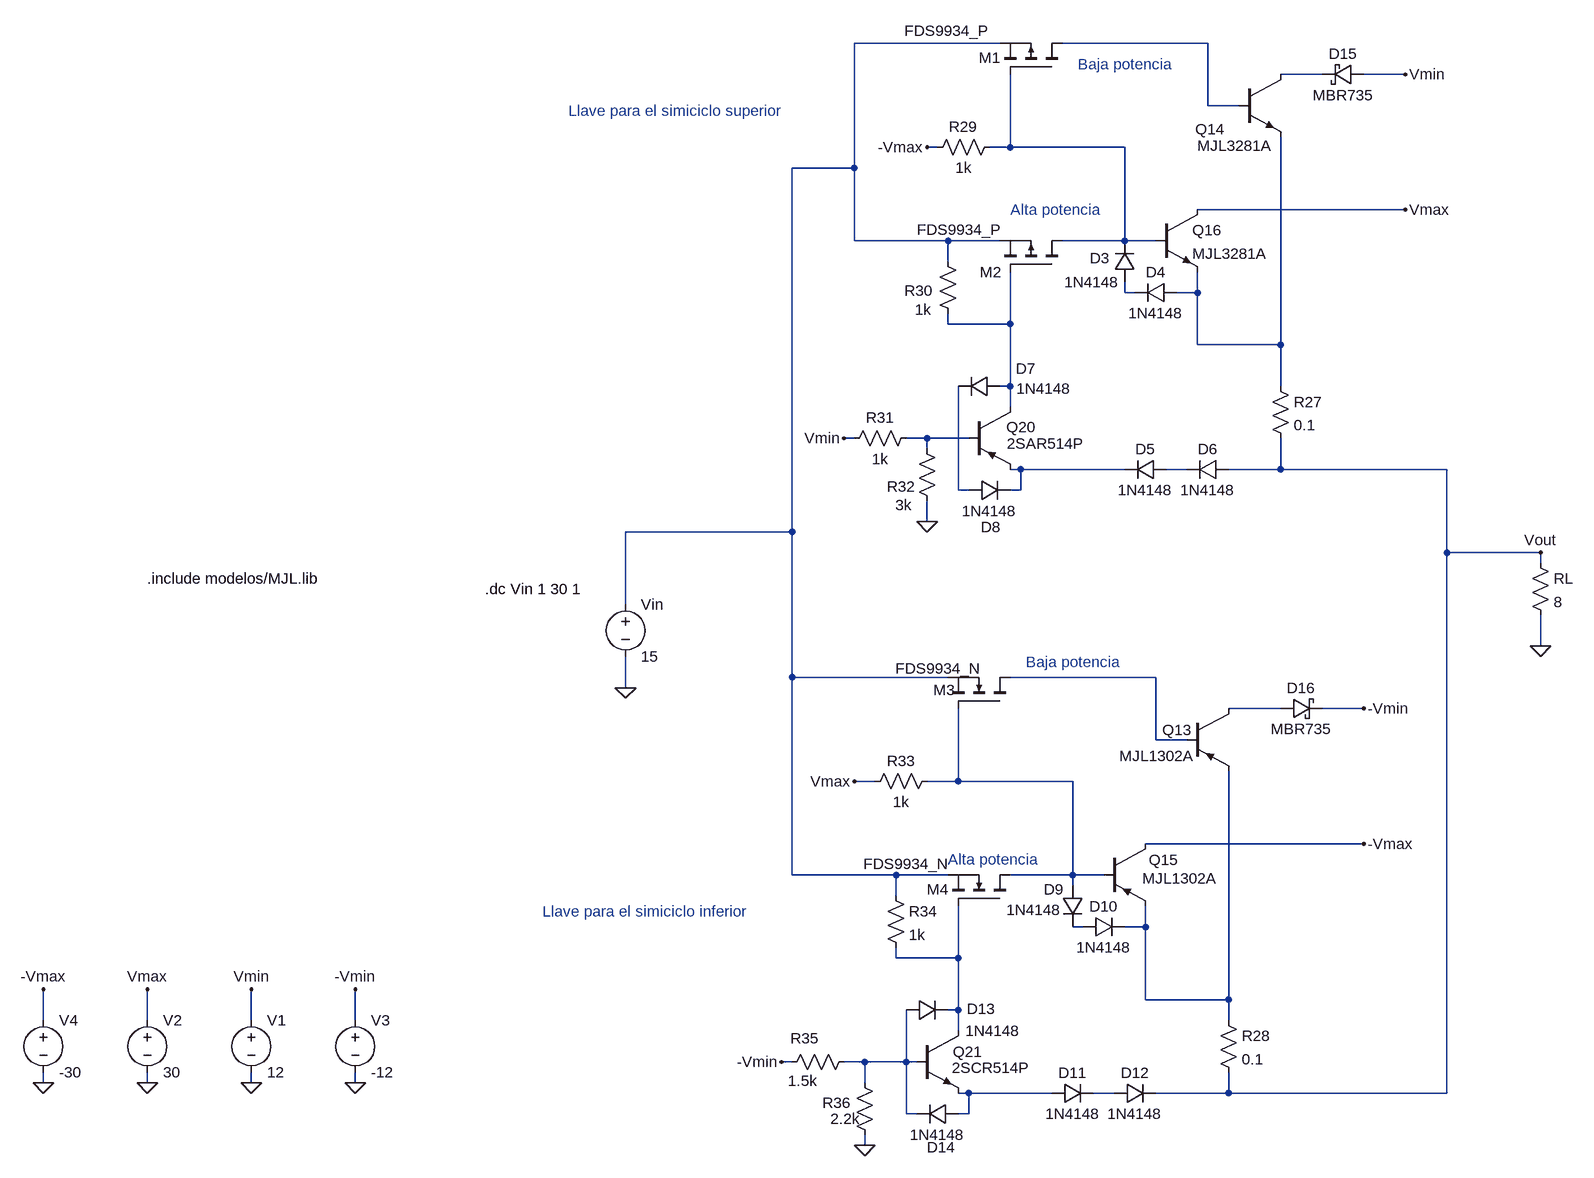
[diagram p0: schematic prueba_llaves_ambos_semiciclos.asc]
prueba_llaves_ambos_semiciclos.asc, the LTspice schematic file:
Version 4
SHEET 1 1968 1748
WIRE 144 -176 -80 -176
WIRE 464 -176 240 -176
WIRE 640 -128 576 -128
WIRE 768 -128 704 -128
WIRE 464 -80 464 -176
WIRE 512 -80 464 -80
WIRE 48 -16 32 -16
WIRE 160 -16 160 -128
WIRE 160 -16 128 -16
WIRE 336 -16 160 -16
WIRE -80 16 -80 -176
WIRE -80 16 -176 16
WIRE 768 80 448 80
WIRE -80 128 -80 16
WIRE 64 128 -80 128
WIRE 144 128 64 128
WIRE 336 128 336 -16
WIRE 336 128 240 128
WIRE 384 128 336 128
WIRE 64 160 64 128
WIRE 336 208 336 192
WIRE 352 208 336 208
WIRE 448 208 448 176
WIRE 448 208 416 208
WIRE 64 256 64 240
WIRE 160 256 160 176
WIRE 160 256 64 256
WIRE 448 288 448 208
WIRE 576 288 576 -32
WIRE 576 288 448 288
WIRE 160 352 160 256
WIRE 160 352 144 352
WIRE 576 352 576 288
WIRE 160 384 160 352
WIRE -80 432 -96 432
WIRE 32 432 0 432
WIRE 96 432 32 432
WIRE 32 448 32 432
WIRE 176 480 160 480
WIRE 336 480 176 480
WIRE 432 480 400 480
WIRE 576 480 576 432
WIRE 576 480 496 480
WIRE 832 480 576 480
WIRE 80 512 80 352
WIRE 96 512 80 512
WIRE 176 512 176 480
WIRE 176 512 160 512
WIRE 32 560 32 528
WIRE -176 576 -176 16
WIRE -176 576 -432 576
WIRE 832 608 832 480
WIRE 976 608 832 608
WIRE 976 624 976 608
WIRE -432 688 -432 576
WIRE 976 752 976 704
WIRE -176 800 -176 576
WIRE 64 800 -176 800
WIRE 384 800 160 800
WIRE -432 816 -432 768
WIRE 576 848 496 848
WIRE 704 848 640 848
WIRE 384 896 384 800
WIRE 432 896 384 896
WIRE -48 960 -80 960
WIRE 80 960 80 848
WIRE 80 960 32 960
WIRE 256 960 80 960
WIRE 704 1056 368 1056
WIRE -176 1104 -176 800
WIRE -16 1104 -176 1104
WIRE 64 1104 -16 1104
WIRE 256 1104 256 960
WIRE 256 1104 160 1104
WIRE 304 1104 256 1104
WIRE 256 1120 256 1104
WIRE -16 1136 -16 1104
WIRE 272 1184 256 1184
WIRE 368 1184 368 1152
WIRE 368 1184 336 1184
WIRE -16 1232 -16 1216
WIRE 80 1232 80 1152
WIRE 80 1232 -16 1232
WIRE 368 1296 368 1184
WIRE 496 1296 496 944
WIRE 496 1296 368 1296
WIRE 80 1312 80 1232
WIRE 80 1312 64 1312
WIRE -1328 1328 -1328 1280
WIRE -1168 1328 -1168 1280
WIRE -1008 1328 -1008 1280
WIRE -848 1328 -848 1280
WIRE 496 1328 496 1296
WIRE 80 1344 80 1312
WIRE -176 1392 -192 1392
WIRE -64 1392 -96 1392
WIRE 0 1392 0 1312
WIRE 0 1392 -64 1392
WIRE 16 1392 0 1392
WIRE -1328 1424 -1328 1408
WIRE -1168 1424 -1168 1408
WIRE -1008 1424 -1008 1408
WIRE -848 1424 -848 1408
WIRE -64 1424 -64 1392
WIRE 96 1440 80 1440
WIRE 224 1440 96 1440
WIRE 320 1440 288 1440
WIRE 496 1440 496 1408
WIRE 496 1440 384 1440
WIRE 832 1440 832 608
WIRE 832 1440 496 1440
WIRE 0 1472 0 1392
WIRE 16 1472 0 1472
WIRE 96 1472 96 1440
WIRE 96 1472 80 1472
WIRE -64 1520 -64 1504
FLAG -1008 1424 0
FLAG -1008 1280 Vmin
FLAG -1168 1280 Vmax
FLAG -1168 1424 0
FLAG -848 1424 0
FLAG -848 1280 -Vmin
FLAG -1328 1280 -Vmax
FLAG -1328 1424 0
FLAG 768 -128 Vmin
FLAG 768 80 Vmax
FLAG -96 432 Vmin
FLAG 32 560 0
FLAG 704 848 -Vmin
FLAG 704 1056 -Vmax
FLAG -192 1392 -Vmin
FLAG 32 -16 -Vmax
FLAG -80 960 Vmax
FLAG 976 608 Vout
FLAG 976 752 0
FLAG -64 1520 0
FLAG -432 816 0
SYMBOL voltage -1008 1312 R0
WINDOW 123 0 0 Left 0
WINDOW 39 0 0 Left 0
SYMATTR InstName V1
SYMATTR Value 12
SYMBOL voltage -1168 1312 R0
WINDOW 123 0 0 Left 0
WINDOW 39 0 0 Left 0
SYMATTR InstName V2
SYMATTR Value 30
SYMBOL voltage -848 1312 R0
WINDOW 123 0 0 Left 0
WINDOW 39 0 0 Left 0
SYMATTR InstName V3
SYMATTR Value -12
SYMBOL voltage -1328 1312 R0
WINDOW 123 0 0 Left 0
WINDOW 39 0 0 Left 0
SYMATTR InstName V4
SYMATTR Value -30
SYMBOL pmos 240 176 M270
WINDOW 0 0 127 VLeft 2
WINDOW 3 65 224 VLeft 2
SYMATTR InstName M2
SYMATTR Value FDS9934_P
SYMBOL pmos 240 -128 M270
WINDOW 0 26 128 VLeft 2
WINDOW 3 67 243 VLeft 2
SYMATTR InstName M1
SYMATTR Value FDS9934_P
SYMBOL pnp 96 384 R0
WINDOW 0 58 31 Left 2
WINDOW 3 59 56 Left 2
SYMATTR InstName Q20
SYMATTR Value 2SAR514P
SYMBOL npn 384 80 R0
SYMATTR InstName Q16
SYMATTR Value MJL3281A
SYMBOL npn 512 -128 R0
WINDOW 0 -67 84 Left 2
WINDOW 3 -64 110 Left 2
SYMATTR InstName Q14
SYMATTR Value MJL3281A
SYMBOL res 16 416 R90
WINDOW 0 0 56 VBottom 2
WINDOW 3 32 56 VTop 2
SYMATTR InstName R31
SYMATTR Value 1k
SYMBOL schottky 704 -144 R90
WINDOW 0 0 32 VBottom 2
WINDOW 3 32 32 VTop 2
SYMATTR InstName D15
SYMATTR Value MBR735
SYMATTR Description Diode
SYMATTR Type diode
SYMBOL res 16 432 R0
WINDOW 0 -46 74 Left 2
WINDOW 3 -33 103 Left 2
SYMATTR InstName R32
SYMATTR Value 3k
SYMBOL res -80 1376 R90
WINDOW 0 -5 76 VBottom 2
WINDOW 3 29 79 VTop 2
SYMATTR InstName R35
SYMATTR Value 1.5k
SYMBOL schottky 576 864 R270
WINDOW 0 32 32 VTop 2
WINDOW 3 0 32 VBottom 2
SYMATTR InstName D16
SYMATTR Value MBR735
SYMATTR Description Diode
SYMATTR Type diode
SYMBOL pnp 432 848 R0
WINDOW 0 -38 33 Left 2
WINDOW 3 -104 73 Left 2
SYMATTR InstName Q13
SYMATTR Value MJL1302A
SYMBOL pnp 304 1056 R0
WINDOW 0 69 25 Left 2
WINDOW 3 59 53 Left 2
SYMATTR InstName Q15
SYMATTR Value MJL1302A
SYMBOL nmos 160 848 M270
WINDOW 0 29 118 VLeft 2
WINDOW 3 62 177 VLeft 2
SYMATTR InstName M3
SYMATTR Value FDS9934_N
SYMBOL nmos 160 1152 M270
WINDOW 0 26 128 VLeft 2
WINDOW 3 65 226 VLeft 2
SYMATTR InstName M4
SYMATTR Value FDS9934_N
SYMBOL npn 16 1344 R0
WINDOW 3 54 57 Left 2
SYMATTR Value 2SCR514P
SYMATTR InstName Q21
SYMBOL res 960 608 R0
SYMATTR InstName RL
SYMATTR Value 8
SYMBOL diode 400 464 R90
WINDOW 0 0 32 VBottom 2
WINDOW 3 32 32 VTop 2
SYMATTR InstName D5
SYMATTR Value 1N4148
SYMBOL diode 224 1456 R270
WINDOW 0 32 32 VTop 2
WINDOW 3 0 32 VBottom 2
SYMATTR InstName D11
SYMATTR Value 1N4148
SYMBOL res 144 -32 R90
WINDOW 0 0 56 VBottom 2
WINDOW 3 32 56 VTop 2
SYMATTR InstName R29
SYMATTR Value 1k
SYMBOL res -64 976 R270
WINDOW 0 32 56 VTop 2
WINDOW 3 0 56 VBottom 2
SYMATTR InstName R33
SYMATTR Value 1k
SYMBOL res 560 336 R0
SYMATTR InstName R27
SYMATTR Value 0.1
SYMBOL diode 96 528 R270
WINDOW 0 -56 34 VTop 2
WINDOW 3 0 32 VBottom 2
SYMATTR InstName D8
SYMATTR Value 1N4148
SYMBOL diode 80 1456 R90
WINDOW 0 83 26 VBottom 2
WINDOW 3 32 32 VTop 2
SYMATTR InstName D14
SYMATTR Value 1N4148
SYMBOL res 480 1312 R0
SYMATTR InstName R28
SYMATTR Value 0.1
SYMBOL diode 416 192 R90
WINDOW 0 0 32 VBottom 2
WINDOW 3 32 32 VTop 2
SYMATTR InstName D4
SYMATTR Value 1N4148
SYMBOL diode 272 1200 R270
WINDOW 0 32 32 VTop 2
WINDOW 3 0 32 VBottom 2
SYMATTR InstName D10
SYMATTR Value 1N4148
SYMBOL diode 144 336 R90
WINDOW 0 4 -40 VBottom 2
WINDOW 3 4 -68 VTop 2
SYMATTR InstName D7
SYMATTR Value 1N4148
SYMBOL diode 0 1328 R270
WINDOW 0 2 115 VTop 2
WINDOW 3 0 133 VBottom 2
SYMATTR InstName D13
SYMATTR Value 1N4148
SYMBOL res -80 1408 R0
WINDOW 0 -49 47 Left 2
WINDOW 3 -37 71 Left 2
SYMATTR InstName R36
SYMATTR Value 2.2k
SYMBOL voltage -432 672 R0
WINDOW 123 0 0 Left 0
WINDOW 39 0 0 Left 0
SYMATTR InstName Vin
SYMATTR Value 15
SYMBOL diode 496 464 R90
WINDOW 0 0 32 VBottom 2
WINDOW 3 32 32 VTop 2
SYMATTR InstName D6
SYMATTR Value 1N4148
SYMBOL diode 320 1456 R270
WINDOW 0 32 32 VTop 2
WINDOW 3 0 32 VBottom 2
SYMATTR InstName D12
SYMATTR Value 1N4148
SYMBOL diode 352 192 R180
WINDOW 0 39 37 Left 2
WINDOW 3 24 0 Left 2
SYMATTR InstName D3
SYMATTR Value 1N4148
SYMBOL diode 240 1120 R0
WINDOW 0 -28 6 Left 2
WINDOW 3 -86 38 Left 2
SYMATTR InstName D9
SYMATTR Value 1N4148
SYMBOL res 48 144 R0
WINDOW 0 -51 61 Left 2
WINDOW 3 -35 90 Left 2
SYMATTR InstName R30
SYMATTR Value 1k
SYMBOL res -32 1120 R0
SYMATTR InstName R34
SYMATTR Value 1k
TEXT -1168 648 Left 2 !.include modelos/MJL.lib
TEXT 264 -144 Left 2 ;Baja potencia
TEXT 160 80 Left 2 ;Alta potencia
TEXT 184 776 Left 2 ;Baja potencia
TEXT 64 1080 Left 2 ;Alta potencia
TEXT -648 664 Left 2 !.dc Vin 1 30 1
TEXT -560 1160 Left 2 ;Llave para el simiciclo inferior
TEXT -520 -72 Left 2 ;Llave para el simiciclo superior

The netlist it stands for:
* prueba_llaves_ambos_semiciclos.asc
V1 Vmin 0 12
V2 Vmax 0 30
V3 -Vmin 0 -12
V4 -Vmax 0 -30
M2 N004 N007 N001 N001 FDS9934_P
M1 N002 N004 N001 N001 FDS9934_P
Q20 N007 N008 N009 0 2SAR514P
Q16 Vmax N004 N006 0 MJL3281A
Q14 N003 N002 N006 0 MJL3281A
R31 N008 Vmin 1k
D15 Vmin N003 MBR735
R32 N008 0 3k
R35 N018 -Vmin 1.5k
D16 N013 -Vmin MBR735
Q13 N013 N012 N016 0 MJL1302A
Q15 -Vmax N014 N016 0 MJL1302A
M3 N012 N014 N001 N001 FDS9934_N
M4 N014 N017 N001 N001 FDS9934_N
Q21 N017 N018 N019 0 2SCR514P
RL Vout 0 8
D5 N010 N009 1N4148
D11 N019 N020 1N4148
R29 N004 -Vmax 1k
R33 Vmax N014 1k
R27 N006 Vout 0.1
D8 N011 N009 1N4148
D14 N019 N018 1N4148
R28 N016 Vout 0.1
D4 N006 N005 1N4148
D10 N015 N016 1N4148
D7 N007 N011 1N4148
D13 N018 N017 1N4148
R36 N018 0 2.2k
Vin N001 0 15
D6 Vout N010 1N4148
D12 N020 Vout 1N4148
D3 N005 N004 1N4148
D9 N014 N015 1N4148
R30 N001 N007 1k
R34 N001 N017 1k
.model D D
.lib standard.dio
.model NPN NPN
.model PNP PNP
.lib standard.bjt
.model NMOS NMOS
.model PMOS PMOS
.lib standard.mos
.include modelos/MJL.lib
* Baja potencia
* Alta potencia
* Baja potencia
* Alta potencia
.dc Vin 1 30 1
* Llave para el simiciclo inferior
* Llave para el simiciclo superior
.backanno
.end